# EasyEDA Pro project 电机驱动板.epro

# Schematic 电机驱动板(stm32)
Create Date: 2024-04-03; Page Name: P1; Project Name: 轮腿机器人; Schematic Name: 电机驱动板(stm32); Update Date: 2024-05-11; Company: 嘉立创EDA; Page Size: A4; Version: V1.0
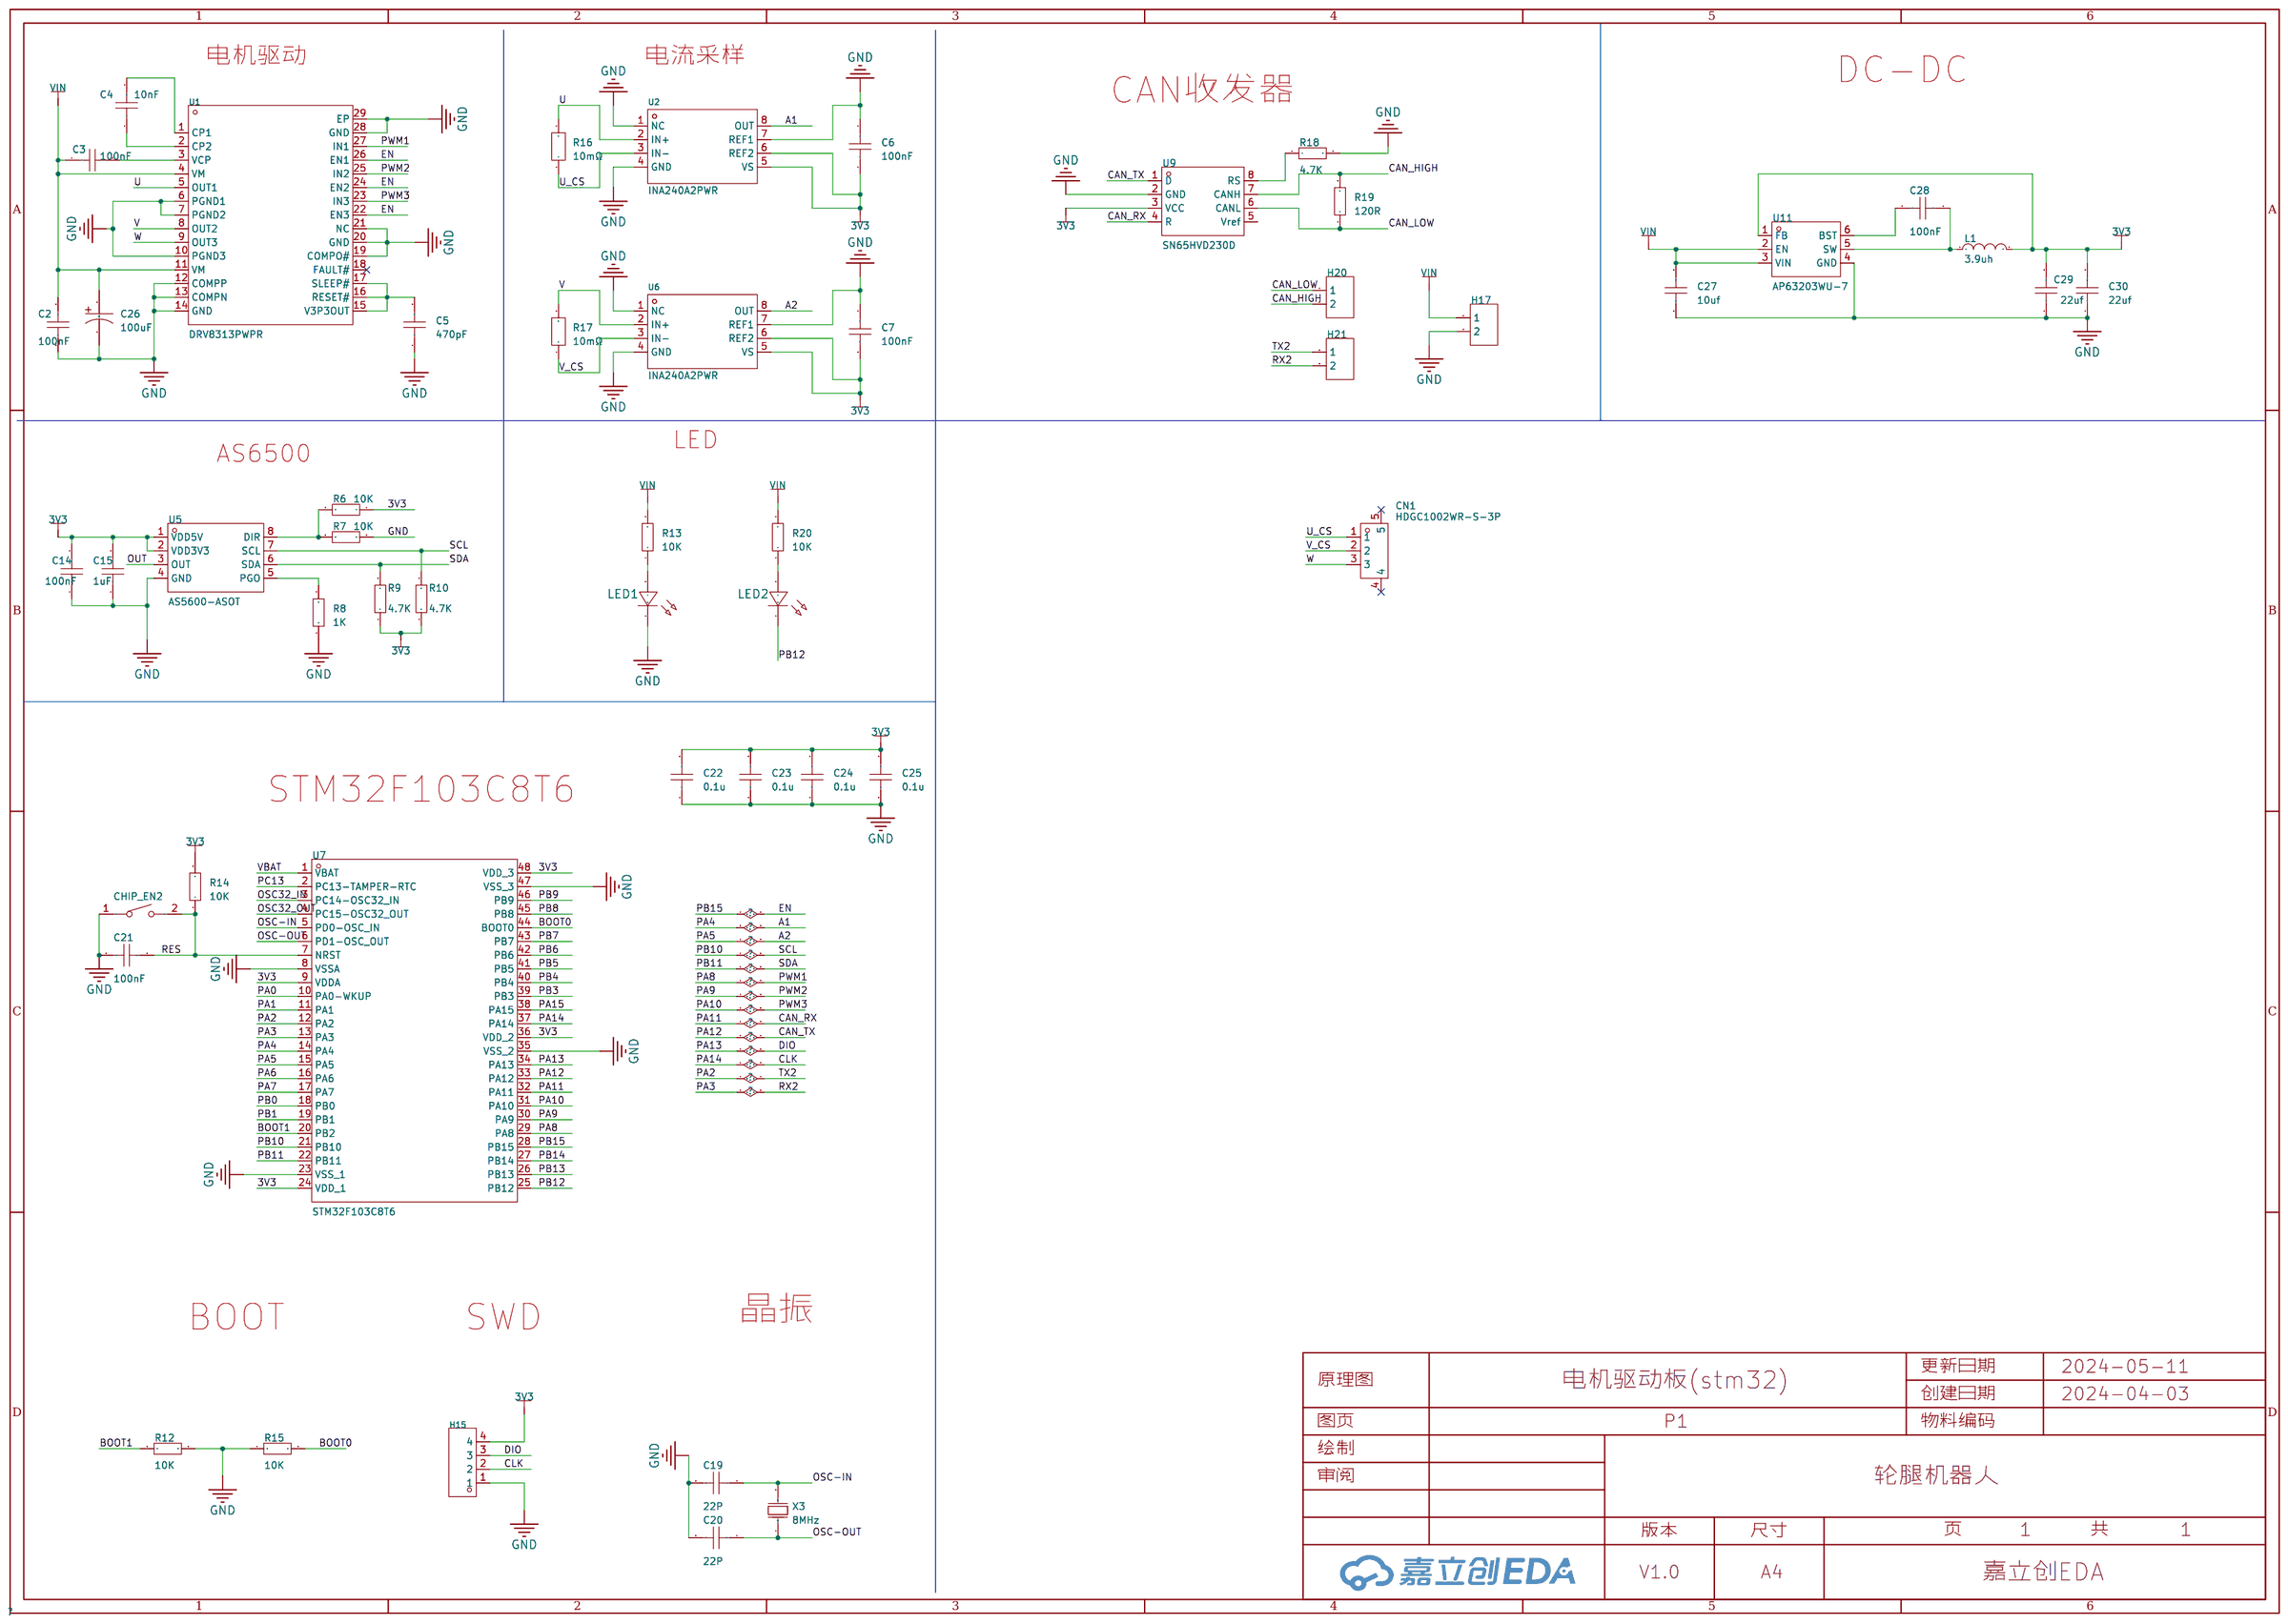
[diagram p0: schematic sheet]

## Parts
C2  100nF  [C0603]
C3  100nF  [C0603]
C4  10nF  [C0603]
C5  470pF  [C0603]
C6  100nF  [C0603]
C7  100nF  [C0603]
C14  100nF  [C0603]
C15  1uF  [C0603]
C19  22P  [C0603]
C20  22P  [C0603]
C21  100nF  [C0603]
C22  0.1u  [C0603]
C23  0.1u  [C0603]
C24  0.1u  [C0603]
C25  0.1u  [C0603]
C26  100uF  [CAP-SMD_L6.0-W3.2-R-RD]
C27  10uf  [C0603]
C28  100nF  [C0603]
C29  22uf  [C0603]
C30  22uf  [C0603]
CHIP_EN2  TS-1088-AR02016  [SW-SMD_L3.9-W3.0-P4.45]
CN1  HDGC1002WR-S-3P  [CONN-SMD_3P-P1.00_HDGC_HDGC1002WR-S-3P]
H15  -  [HDR-TH_4P-P2.54-V-F]
H17  -  [HDR-TH_2P-P2.54-V-F]
H20  -  [HDR-TH_2P-P2.54-V-F]
H21  -  [HDR-TH_2P-P2.54-V-F]
L1  3.9uh  [IND-SMD_L4.0-W4.0]
LED1  -  [LED_0603]
LED2  -  [LED_0603]
R6  10K  [R0603]
R7  10K  [R0603]
R8  1K  [R0603]
R9  4.7K  [R0603]
R10  4.7K  [R0603]
R12  10K  [R0603]
R13  10K  [R0603]
R14  10K  [R0603]
R15  10K  [R0603]
R16  10mΩ  [R1206]
R17  10mΩ  [R1206]
R18  4.7K  [R0603]
R19  120R  [R0603]
R20  10K  [R0603]
U1  DRV8313PWPR  [HTSSOP-28_L9.8-W4.5-P0.65-LS6.6-BL-EP]
U2  INA240A2PWR  [TSSOP-8_L4.4-W3.0-P0.65-LS6.4-BL]
U5  AS5600-ASOT  [SOIC-8_L5.0-W4.0-P1.27-LS6.0-BL]
U6  INA240A2PWR  [TSSOP-8_L4.4-W3.0-P0.65-LS6.4-BL]
U7  STM32F103C8T6  [LQFP-48_L7.0-W7.0-P0.50-LS9.0-BL]
U9  SN65HVD230D  [SOIC-8_L4.9-W3.9-P1.27-LS6.0-BL]
U11  AP63203WU-7  [TSOT-26_L2.9-W1.6-P0.95-LS2.8-BL]
X3  8MHz  [CRYSTAL-SMD_L5.0-W3.2]

## Library data of the parts
C2-C7 C14 C15 C19-C25 C27-C30 = CAP_0603: Supplier Footprint: 0603
C26 = CA45-C-10V-100μF-K: 容值:100uF;精度:±10%;额定电压:10V;等效串联电阻:300mΩ@100kHz;; LCSC Part Name: 100uF ±10% 10V; Supplier Part: C171664; Manufacturer: TORCH(火炬); Supplier Footprint: CASE-C-6032; JLCPCB Part Class: 扩展库; Datasheet: https://atta.szlcsc.com/upload/public/pdf/source/20180207/C171664_15179894835581356208.pdf; Supplier: LCSC; Tolerance: ±10%; Rated Voltage: 10V; Equivalent Series Resistance(ESR): 300mΩ@100kHz; Operating Temperature: -55℃~+125℃
CHIP_EN2 = TS-1088-AR02016: 触点电流:50mA;额定电压(DC):12V;绝缘电阻:100MΩ;电路结构:单刀单掷;安装方式:立贴;作用力:160gf@±50gf;机械寿命:10万次;带支架:否;; LCSC Part Name: 4*3*2mm 立贴 轻触开关; Supplier Part: C720477; Manufacturer: XUNPU(讯普); Supplier Footprint: SMD; JLCPCB Part Class: 扩展库; Datasheet: https://atta.szlcsc.com/upload/public/pdf/source/20200810/C720475_60D09DD6C54279ADDB2DC25100F1CC11.pdf; Supplier: LCSC; Contact Current: 50mA; Voltage Rating (DC): 12V; Insulation Resistance: 100MΩ; Circuit: 单刀单掷; Mounting Style: 立贴; Actuator Style: 圆形按钮; Actuator/Cap Color: 黑色; Operating Force: 160gf@±50gf; Mechanical Life: 10万次; Operating Temperature: -30℃~+80℃; Pin Style: SMD接片; Switch Length: 4mm; Switch Width: 3mm; Switch Height: 2mm; Strike Gundam: 否
CN1 = HDGC1002WR-S-3P: 参考系列:-;间距:1mm;插针结构:1x3P;排数:1;每排PIN数:3;行距:-;公母:公型插针;安装方式:卧贴;额定电流:1A;工作温度范围:-25℃~+70℃;; LCSC Part Name: 间距:1mm 1x3P 卧贴; Supplier Part: C2936213; Manufacturer: HDGC(华德共创); Supplier Footprint: SMD,P=1mm; JLCPCB Part Class: 扩展库; Datasheet: https://atta.szlcsc.com/upload/public/pdf/source/20211229/E8A09E85670B5E97244D2008A24D97FE.pdf; Supplier: LCSC; Pitch: 1mm; Pins Structure: 1x3P; Number of Rows: 1; Number of PINs Per Row: 3; Gender: 公型插针; Mounting Style: 卧贴; Current Rating (Max): 1A; Operating Temperature Range: -25℃~+70℃
H15 = HDR-F_2.54_1x4P: Supplier Part: C2718488; Supplier Footprint: 插件
H17 H20 H21 = HDR-F_2.54_1x2P: Supplier Part: C49661; Supplier Footprint: 插件
L1 = SWPA4030S681MT: 电感值:680uH;精度:±20%;额定电流:140mA;饱和电流(Isat):190mA;; LCSC Part Name: 680uH ±20% 190mA; Supplier Part: C370482; Manufacturer: Sunlord(顺络); Supplier Footprint: 4030; JLCPCB Part Class: 扩展库; Datasheet: https://atta.szlcsc.com/upload/public/pdf/source/20231024/317626D2AA2F8AB4113C1875E432E6E1.pdf; Supplier: LCSC; Tolerance: ±20%; Rated Current: 140mA; Saturation Current (Isat): 190mA; DC Resistance (DCR): 9.854Ω
LED1 LED2 = LED_0603-R: Supplier Footprint: 0603
R6-R10 R12-R15 R18-R20 = Res_0603: Supplier Footprint: 0603
R16 R17 = MFJ06HR010FT: 电阻类型:采样电阻;阻值:10mΩ;精度:±1%;功率:1W;温度系数:±50ppm/℃;; LCSC Part Name: 10mΩ ±1% 1W; Supplier Part: C2961483; Manufacturer: FH(风华); Supplier Footprint: 1206; JLCPCB Part Class: 扩展库; Datasheet: https://atta.szlcsc.com/upload/public/pdf/source/20220214/48262AE2350561E4ADC39CA7942CE443.pdf; Supplier: LCSC; Type: 采样电阻; Tolerance: ±1%; Power(Watts): 1W; Temperature Coefficient: ±50ppm/℃
U1 = DRV8313PWPR: 类型:无刷直流BLDC;电源电压:8V~60V;输出电流:-;接口:并行;; LCSC Part Name: 无刷直流BLDC电机驱动芯片 60V; Supplier Part: C92482; Manufacturer: TI(德州仪器); Supplier Footprint: TSSOP-28-EP; JLCPCB Part Class: 扩展库; Datasheet: https://www.ti.com/cn/lit/gpn/drv8313; Supplier: LCSC; Type: 无刷直流BLDC; Supply Voltage: 8V~60V; Interface: 并行; Operating Temperature: -40℃~+150℃@(Tj)
U2 U6 = INA240A2PWR: 通道数:1;; Supplier Part: C129949; Manufacturer: TI(德州仪器); Supplier Footprint: TSSOP-8; JLCPCB Part Class: 扩展库; Datasheet: https://www.ti.com/cn/lit/gpn/ina240; Supplier: LCSC; Number of Channels: 1; Supply Current: 1.8mA; Operating Temperature: -40℃~+125℃
U5 = AS5600-ASOT: Supplier Part: C499458; Manufacturer: ams(艾迈斯半导体); Supplier Footprint: SOIC-8; JLCPCB Part Class: 扩展库; Datasheet: https://atta.szlcsc.com/upload/public/pdf/source/20200324/C499458_E1461AFB0CE1042DE5756821C534625C.pdf; Supplier: LCSC
U7 = STM32F103C8T6: CPU内核:ARM Cortex-M3;CPU最大主频:72MHz;程序存储容量:64KB;程序存储器类型:FLASH;RAM总容量:20KB;GPIO端口数量:37;; LCSC Part Name: ARM Cortex-M3 72MHz MSL=3; Supplier Part: C8734; Manufacturer: ST(意法半导体); Supplier Footprint: LQFP-48(7x7); JLCPCB Part Class: 基础库; Datasheet: https://atta.szlcsc.com/upload/public/pdf/source/20220812/8363ACEC51AD55ECEB84799464F7CB85.pdf; Supplier: LCSC; CPU Core: ARM Cortex-M3; CPU Maximum Speed: 72MHz; Operating Voltage Range: 2V~3.6V; Program Storage Size: 64KB; Program Memory Type: FLASH; RAM Size: 20KB; GPIO Ports Number: 37; ADC (Bit): 12bit; Universal Serial Bus: 有; Peripheral/Function: 看门狗；DMA；看门狗；片载温度传感器; Watchdog: 有; Infrared Data Association: 有; Low-Voltage Detect: 有; Direct Memory Access: 有; Internal Oscillator: 有; Operating Temperature Range: -40℃~+85℃
U9 = SN65HVD230D: 类型:收发器;数据速率:1Mbps;; Supplier Part: C1543812; Manufacturer: TI(德州仪器); Supplier Footprint: SOIC-8; JLCPCB Part Class: 扩展库; Datasheet: https://www.ti.com/cn/lit/gpn/sn65hvd232; Supplier: LCSC; Type: 收发器; Data Rate: 1Mbps; Supply Voltage: 3V~3.6V; Operating Temperature: -40℃~+85℃
U11 = AP63203WU-7: 功能类型:降压型;输出类型:固定;输入电压:3.8V~32V;输出电压:3.3V;输出电流(最大值):2A;; Supplier Part: C780769; Manufacturer: DIODES(美台); Supplier Footprint: TSOT-23-6; JLCPCB Part Class: 扩展库; Datasheet: https://atta.szlcsc.com/upload/public/pdf/source/20210622/C780769_099C67289BD3EC61AAFB52D8B07125B3.pdf; Supplier: LCSC; Function: 降压型; Output Type: 固定; Input Voltage: 3.8V~32V; Output Voltage: 3.3V; Output Current (Max): 2A; Switching Frequency: 1.1MHz; Operating Temperature: -40℃~+85℃@(TA); Synchronous Rectification: 是; Number of Outputs: 1; Topology: 降压式; Switch tube (built-in/external): 内置
X3 = X50328MSB2GI: 晶振类型:贴片晶振;频率:8MHz;常温频差:±10ppm;外接负载电容:20pF;频率稳定度(全温):±20ppm;; LCSC Part Name: 8MHz ±10ppm 20pF YSX530GA; Supplier Part: C115962; Manufacturer: YXC(扬兴晶振); Supplier Footprint: SMD5032; JLCPCB Part Class: 基础库; Datasheet: https://atta.szlcsc.com/upload/public/pdf/source/20240329/44922B0AF7B60E58E9B66993B6077277.pdf; Supplier: LCSC; Crystal Type: 贴片晶振; Normal temperature Frequency Tolerance: ±10ppm; External load capacitor: 20pF; Frequency Stability(Full temperature range): ±20ppm; Operating Temperature: -40℃~+85℃

## Nets
3V3: C6.2 C7.2 C14.2 C15.2 C22.2 C23.2 C24.2 C25.2 C29.2 C30.2 H15.4 L1.2 R6.1 R9.1 R10.1 R14.2 U2.5(VS) U2.6(REF2) U5.1(VDD5V) U5.2(VDD3V3) U6.5(VS) U6.6(REF2) U7.9(VDDA) U7.24(VDD_1) U7.36(VDD_2) U7.48(VDD_3) U9.3(VCC) U11.1(FB)
GND: C2.1 C5.1 C6.1 C7.1 C14.1 C15.1 C19.2 C20.2 C21.1 C22.1 C23.1 C24.1 C25.1 C26.2 C27.1 C29.1 C30.1 CHIP_EN2.1 H15.1 H17.2 LED1.1(C) R7.2 R8.1 R12.2 R15.1 R18.2 U1.6(PGND1) U1.7(PGND2) U1.10(PGND3) U1.12(COMPP) U1.13(COMPN) U1.14(GND) U1.19(COMPO#) U1.20(GND) U1.21(NC) U1.28(GND) U1.29(EP) U2.1(NC) U2.4(GND) U2.7(REF1) U5.4(GND) U6.1(NC) U6.4(GND) U6.7(REF1) U7.8(VSSA) U7.23(VSS_1) U7.35(VSS_2) U7.47(VSS_3) U9.2(GND) U11.4(GND)
VBAT: U7.1(VBAT)
VIN: C2.2 C3.1 C26.1 C27.2 H17.1 R13.2 R20.2 U1.4(VM) U1.11(VM) U11.2(EN) U11.3(VIN)
A1: U2.8(OUT) U7.14(PA4)
A2: U6.8(OUT) U7.15(PA5)
BOOT0: R15.2 U7.44(BOOT0)
BOOT1: R12.1 U7.20(PB2)
CAN_HIGH: H20.2 R19.2 U9.7(CANH)
CAN_LOW: H20.1 R19.1 U9.6(CANL)
CAN_RX: U7.32(PA11) U9.4(R)
CAN_TX: U7.33(PA12) U9.1(D)
CLK: H15.2 U7.37(PA14)
DIO: H15.3 U7.34(PA13)
EN: U1.22(EN3) U1.24(EN2) U1.26(EN1) U7.28(PB15)
OSC32_IN: U7.3(PC14-OSC32_IN)
OSC32_OUT: U7.4(PC15-OSC32_OUT)
OSC-IN: C19.1 U7.5(PD0-OSC_IN) X3.2(OSC2)
OSC-OUT: C20.1 U7.6(PD1-OSC_OUT) X3.1(OSC1)
OUT: U5.3(OUT)
PA0: U7.10(PA0-WKUP)
PA1: U7.11(PA1)
PA2: H21.1 U7.12(PA2)
PA3: H21.2 U7.13(PA3)
PA6: U7.16(PA6)
PA7: U7.17(PA7)
PA8: U1.27(IN1) U7.29(PA8)
PA9: U1.25(IN2) U7.30(PA9)
PA10: U1.23(IN3) U7.31(PA10)
PA15: U7.38(PA15)
PB0: U7.18(PB0)
PB1: U7.19(PB1)
PB3: U7.39(PB3)
PB4: U7.40(PB4)
PB5: U7.41(PB5)
PB6: U7.42(PB6)
PB7: U7.43(PB7)
PB8: U7.45(PB8)
PB9: U7.46(PB9)
PB10: R10.2 U5.7(SCL) U7.21(PB10)
PB11: R9.2 U5.6(SDA) U7.22(PB11)
PB12: LED2.1(C) U7.25(PB12)
PB13: U7.26(PB13)
PB14: U7.27(PB14)
PC13: U7.2(PC13-TAMPER-RTC)
RES: C21.2 CHIP_EN2.2 R14.1 U7.7(NRST)
U: R16.2 U1.5(OUT1) U2.2(IN+)
U_CS: CN1.1 R16.1 U2.3(IN-)
V: R17.2 U1.8(OUT2) U6.2(IN+)
V_CS: CN1.2 R17.1 U6.3(IN-)
W: CN1.3 U1.9(OUT3)
$1N1543: C3.2 U1.3(VCP)
$1N1545: C4.2 U1.1(CP1)
$1N1546: C4.1 U1.2(CP2)
$1N1568: C5.2 U1.15(V3P3OUT) U1.16(RESET#) U1.17(SLEEP#)
$1N1605: R6.2 R7.1 U5.8(DIR)
$1N1610: R8.2 U5.5(PGO)
$1N1619: LED1.2(A) R13.1
$1N6079: R18.1 U9.8(RS)
$1N11263: C28.2 U11.6(BST)
$1N11271: C28.1 L1.1 U11.5(SW)
$1N15188: LED2.2(A) R20.1

Not connected (* = marked no-connect by the designer): CN1 4* 5*; U1 18(FAULT#)*; U9 5(Vref)

## Notes on the sheet
- 电机驱动
- 电流采样
- DC-DC
- CAN收发器
- LED
- AS6500
- STM32F103C8T6
- 晶振
- BOOT
- SWD

# Board 电机驱动板(stm32)
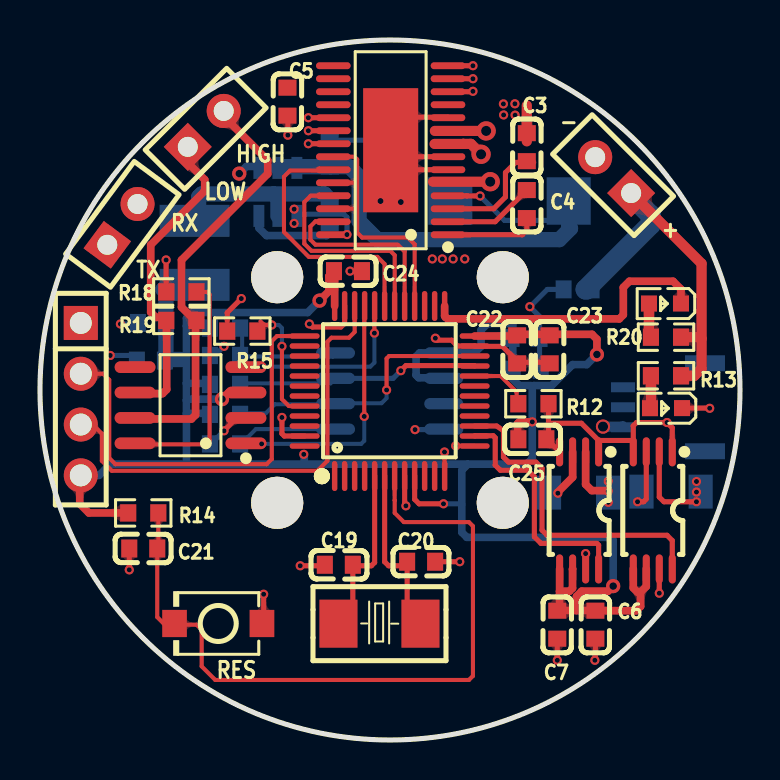
[diagram p1: board, top side]
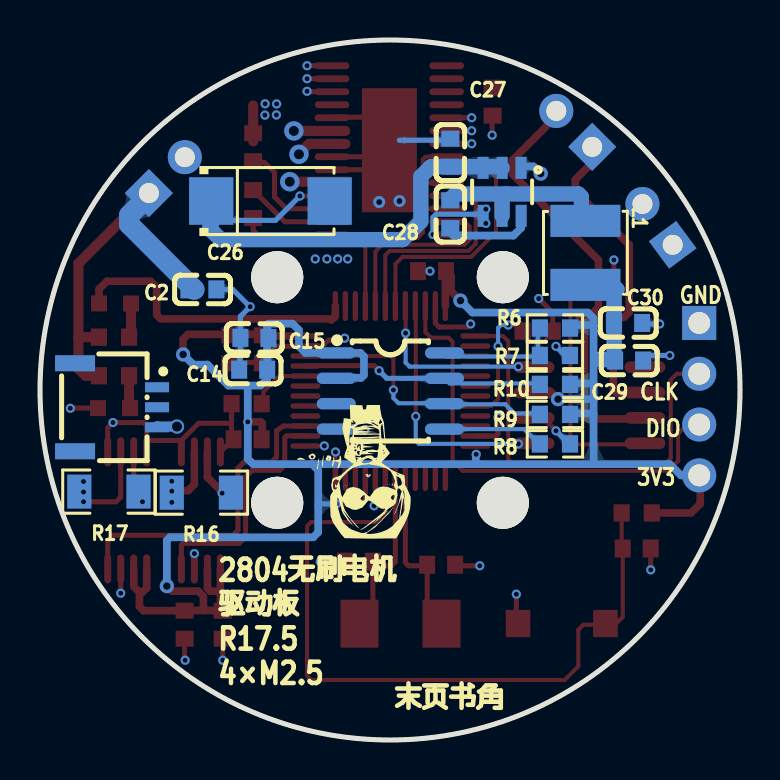
[diagram p2: board, bottom side, seen from below]

Outline 35 x 35 mm; copper layers: Top Layer, GND, VCC, Bottom Layer. Coordinates in mm from the lower left corner of the outline.
Outline path: circle c17.5,17.5 r17.5
Stack: Top Layer 0.035mm 外层铜厚1oz / Dielectric1 0.2104mm 7628 RC49% 8.6mil / GND 0.0152mm 内层铜厚 / Dielectric2 1.065mm 1.1mm H/HOZ 含铜 / VCC 0.0152mm 内层铜厚 / Dielectric3 0.2104mm 7628 RC49% 8.6mil / Bottom Layer 0.035mm 外层铜厚1oz

## Design rules (mm)
template: 自定义配置
spacing copperThickness1oz (default): track to track 0.102, other pairs 0.152 to 0.3
spacing copperThickness2oz: track to track 0.203, other pairs 0.152 to 0.3
track width copperThickness1oz (default): min 0.127, default 0.254, max 2.54
track width copperThickness2oz: min 0.203, default 0.254, max 2.54
differential pair differentialPair (default): width min 0.127, default 0.254, max 2.54; gap min 0.152, default 0.152
via viaSize (default): diameter min 0.457, default 0.61, max 10; hole min 0.254, default 0.305, max 6.299

## Placement (name value [footprint] x y rotation side)
C2  100nF  [C0603]  26.88 22.53 0 bottom
C3  100nF  [C0603]  24.34 29.64 270 top
C4  10nF  [C0603]  24.34 26.8 270 top
C5  470pF  [C0603]  12.37 31.92 90 top
C6  100nF  [C0603]  27.77 5.77 90 top
C7  100nF  [C0603]  25.86 5.77 90 top
C14  100nF  [C0603]  24.34 18.52 180 bottom
C15  1uF  [C0603]  24.28 20.11 180 bottom
C19  22P  [C0603]  14.94 8.76 180 top
C20  22P  [C0603]  19.06 8.91 0 top
C21  100nF  [C0603]  5.16 9.58 0 top
C22  0.1u  [C0603]  23.86 19.53 90 top
C23  0.1u  [C0603]  25.48 19.53 90 top
C24  0.1u  [C0603]  15.4 23.44 180 top
C25  0.1u  [C0603]  24.62 15.04 180 top
C26  100uF  [CAP-SMD_L6.0-W3.2-R-RD]  23.48 26.95 0 bottom
C27  10uf  [C0603]  14.49 29.36 270 bottom
C28  100nF  [C0603]  14.49 26.29 270 bottom
C29  22uf  [C0603]  5.6 20.85 0 bottom
C30  22uf  [C0603]  5.54 18.97 0 bottom
CHIP_EN2  TS-1088-AR02016  [SW-SMD_L3.9-W3.0-P4.45]  8.91 5.83 180 top
CN1  HDGC1002WR-S-3P  [CONN-SMD_3P-P1.00_HDGC_HDGC1002WR-S-3P]  31.2 16.64 270 bottom
H15  -  [HDR-TH_4P-P2.54-V-F]  2.04 17.04 270 top
H17  -  [HDR-TH_2P-P2.54-V-F]  28.66 28.24 135 top
H20  -  [HDR-TH_2P-P2.54-V-F]  8.29 30.56 45 top
H21  -  [HDR-TH_2P-P2.54-V-F]  4.12 25.78 53.4 top
L1  3.9uh  [IND-SMD_L4.0-W4.0]  7.73 24.36 270 bottom
LED1  -  [LED_0603]  31.25 16.59 180 top
LED2  -  [LED_0603]  31.2 21.82 180 top
NOREF  -  [Pad_e61]  11.86 11.86 225 top
NOREF#2  -  [Pad_e60]  23.14 11.86 315 top
NOREF#3  -  [Pad_e59]  11.86 23.14 135 top
NOREF#4  -  [Pad_e58]  23.14 23.14 45 top
R6  10K  [R0603]  9.25 20.6 0 bottom
R7  10K  [R0603]  9.25 19.23 180 bottom
R8  1K  [R0603]  9.25 14.81 0 bottom
R9  4.7K  [R0603]  9.25 16.28 0 bottom
R10  4.7K  [R0603]  9.25 17.78 0 bottom
R12  10K  [R0603]  24.67 16.81 0 top
R13  10K  [R0603]  31.3 18.21 0 top
R14  10K  [R0603]  5.16 11.35 180 top
R15  10K  [R0603]  10.12 20.45 0 top
R16  10mΩ  [R1206]  26.93 12.37 0 bottom
R17  10mΩ  [R1206]  31.55 12.42 0 bottom
R18  4.7K  [R0603]  7.07 22.4 180 top
R19  120R  [R0603]  7.07 20.98 0 top
R20  10K  [R0603]  31.3 20.14 0 top
U1  DRV8313PWPR  [HTSSOP-28_L9.8-W4.5-P0.65-LS6.6-BL-EP]  17.53 29.49 90 top
U2  INA240A2PWR  [TSSOP-8_L4.4-W3.0-P0.65-LS6.4-BL]  26.96 11.48 180 top
U5  AS5600-ASOT  [SOIC-8_L5.0-W4.0-P1.27-LS6.0-BL]  17.48 17.45 270 bottom
U6  INA240A2PWR  [TSSOP-8_L4.4-W3.0-P0.65-LS6.4-BL]  30.64 11.48 180 top
U7  STM32F103C8T6  [LQFP-48_L7.0-W7.0-P0.50-LS9.0-BL]  17.48 17.45 0 top
U9  SN65HVD230D  [SOIC-8_L4.9-W3.9-P1.27-LS6.0-BL]  7.53 16.74 90 top
U11  AP63203WU-7  [TSOT-26_L2.9-W1.6-P0.95-LS2.8-BL]  11.89 27.41 0 bottom
X3  8MHz  [CRYSTAL-SMD_L5.0-W3.2]  16.97 5.82 180 top

## Footprints (pads in the part's own frame, mm; a bottom-side part is the same pattern mirrored in y, then rotated)
C0603
  rect 0.8x0.9 smd: 1(-0.7,0) 2(0.7,0)
CAP-SMD_L6.0-W3.2-R-RD
  rect 2.208x2.376 smd: 1(2.961,0) 2(-2.961,0)
CONN-SMD_3P-P1.00_HDGC_HDGC1002WR-S-3P
  rect 0.5x1.2 smd: 1(-1,2.05) 2(0,2.05) 3(1,2.05)
  rect 0.8x2 smd: 4(2.2,-2.05) 5(-2.2,-2.05)
CRYSTAL-SMD_L5.0-W3.2
  rect 1.9x2.4 smd: 1(-2.05,0) 2(2.05,0)
HDR-TH_2P-P2.54-V-F
  rect 1.7x1.7 hole 1: 1(-1.27,0)
  round 1.7 hole 1: 2(1.27,0)
HDR-TH_4P-P2.54-V-F
  rect 1.7x1.7 hole 1.1: 1(-3.81,0)
  round 1.7 hole 1.1: 2(-1.27,0) 3(1.27,0) 4(3.81,0)
HTSSOP-28_L9.8-W4.5-P0.65-LS6.6-BL-EP
  oval 0.343x1.732 smd: 1(-4.225,-2.866) 2(-3.575,-2.866) 3(-2.925,-2.866) 4(-2.275,-2.866) 5(-1.625,-2.866) 6(-0.975,-2.866) 7(-0.325,-2.866) 8(0.325,-2.866) 9(0.975,-2.866) 10(1.625,-2.866) 11(2.275,-2.866) 12(2.925,-2.866) 13(3.575,-2.866) 14(4.225,-2.866) 15(4.225,2.866) 16(3.575,2.866) 17(2.925,2.866) 18(2.275,2.866) 19(1.625,2.866) 20(0.975,2.866) 21(0.325,2.866) 22(-0.325,2.866) 23(-0.975,2.866) 24(-1.625,2.866) 25(-2.275,2.866) 26(-2.925,2.866) 27(-3.575,2.866) 28(-4.225,2.866)
  rect 6.2x2.75 smd: 29(0,0)
IND-SMD_L4.0-W4.0
  rect 1.6x3.5 smd: 1(-1.6,0) 2(1.6,0)
LED_0603
  rect 0.8x0.8 smd: 1(-0.851,-0.01) 2(0.75,-0.005)
LQFP-48_L7.0-W7.0-P0.50-LS9.0-BL
  oval 0.27x1.5 smd: 1(-2.75,-4.25) 2(-2.25,-4.25) 3(-1.75,-4.25) 4(-1.25,-4.25) 5(-0.75,-4.25) 6(-0.25,-4.25) 7(0.25,-4.25) 8(0.75,-4.25) 9(1.25,-4.25) 10(1.75,-4.25) 11(2.25,-4.25) 12(2.75,-4.25) 25(2.75,4.25) 26(2.25,4.25) 27(1.75,4.25) 28(1.25,4.25) 29(0.75,4.25) 30(0.25,4.25) 31(-0.25,4.25) 32(-0.75,4.25) 33(-1.25,4.25) 34(-1.75,4.25) 35(-2.25,4.25) 36(-2.75,4.25)
  oval 1.5x0.27 smd: 13(4.25,-2.75) 14(4.25,-2.25) 15(4.25,-1.75) 16(4.25,-1.25) 17(4.25,-0.75) 18(4.25,-0.25) 19(4.25,0.25) 20(4.25,0.75) 21(4.25,1.25) 22(4.25,1.75) 23(4.25,2.25) 24(4.25,2.75) 37(-4.25,2.75) 38(-4.25,2.25) 39(-4.25,1.75) 40(-4.25,1.25) 41(-4.25,0.75) 42(-4.25,0.25) 43(-4.25,-0.25) 44(-4.25,-0.75) 45(-4.25,-1.25) 46(-4.25,-1.75) 47(-4.25,-2.25) 48(-4.25,-2.75)
Pad_e58
  round 2.6 hole 2.6: 9(0,0)
Pad_e59
  round 2.6 hole 2.6: 9(0,0)
Pad_e60
  round 2.6 hole 2.6: 9(0,0)
Pad_e61
  round 2.6 hole 2.6: 9(0,0)
R0603
  rect 0.806x0.864 smd: 1(-0.753,0) 2(0.753,0)
R1206
  rect 1.208x1.701 smd: 1(-1.479,0) 2(1.479,0)
SOIC-8_L4.9-W3.9-P1.27-LS6.0-BL
  oval 0.588x2.045 smd: 1(-1.905,-2.772) 2(-0.635,-2.772) 3(0.635,-2.772) 4(1.905,-2.772) 5(1.905,2.772) 6(0.635,2.772) 7(-0.635,2.772) 8(-1.905,2.772)
SOIC-8_L5.0-W4.0-P1.27-LS6.0-BL
  oval 0.569x1.95 smd: 1(-1.905,-2.705) 2(-0.635,-2.705) 3(0.635,-2.705) 4(1.905,-2.705) 5(1.905,2.705) 6(0.635,2.705) 7(-0.635,2.705) 8(-1.905,2.705)
SW-SMD_L3.9-W3.0-P4.45
  rect 1.23x1.36 smd: 1(-2.185,0) 2(2.185,0)
TSOT-26_L2.9-W1.6-P0.95-LS2.8-BL
  rect 0.55x1.1 smd: 1(-0.95,-1.2) 2(0,-1.2) 3(0.95,-1.2) 4(0.95,1.2) 5(0,1.2) 6(-0.95,1.2)
TSSOP-8_L4.4-W3.0-P0.65-LS6.4-BL
  oval 0.353x1.454 smd: 1(-0.975,-2.927) 2(-0.325,-2.927) 3(0.325,-2.927) 4(0.975,-2.927) 5(0.975,2.927) 6(0.325,2.927) 7(-0.325,2.927) 8(-0.975,2.927)

## Nets
As in the schematic.

Pads without a net: CN1 4 5; NOREF 9; NOREF#2 9; NOREF#3 9; NOREF#4 9; U1 18; U9 5

## Via types
v1: diameter 0.457, hole 0.254, Top Layer to Bottom Layer, 63 vias
v2: diameter 0.6, hole 0.3, Top Layer to Bottom Layer, 2 vias
v3: diameter 0.965, hole 0.508, Top Layer to Bottom Layer, 3 vias
v4: diameter 0.711, hole 0.381, Top Layer to Bottom Layer, 5 vias
v5: diameter 0.711, hole 0.508, Top Layer to Bottom Layer, 1 via

## Routing (per net, layer and track width the routed paths; a pad name or vN(x,y) marks a point on that pad's centre or on a via; arc(x,y) is an arc through that point)
3V3: length 129
  Top Layer w0.254: v1(20.17,11.81) 18.96,11.81 18.73,12.03 U7.9
  Top Layer w0.381: R14.2 2.45,11.35 1.99,11.81 1.99,13.18 H15.4 ; 30.03,7.39 29.88,7.39 29.66,7.6 U6.5 ; 30.03,7.39 30.31,7.67 U6.6 ; 30.03,7.39 30.03,6.68 29.82,6.47 C6.2 27.76,6.48 26.83,6.48 ; 26.83,6.48 25.88,6.48 ; 26.83,6.48 26.83,7.19 27.08,7.44 28.4,7.44 v4(28.66,7.7) ; 25.88,6.48 25.98,6.58 25.98,7.44 ; 25.88,6.48 C7.2 ; v4(9.1,17.04) 9.43,17.37 U9.3 ; v4(27.85,19.28) 27.85,20.04 27.6,20.28 23.86,20.28 23.77,20.2 U7.24 ; U2.6 26.63,8.55 26.63,7.59 26.47,7.44 25.98,7.44 ; 23.87,15.04 23.88,15.05 23.88,15.82 23.97,15.91 v1(24.61,15.91) ; 25.98,7.44 U2.5 ; v4(13.98,21.97) 14.45,22.44 14.45,23.19 C24.2 14.73,23.41 U7.36
  VCC w0.381: v4(9.96,28.32) 9.96,25.5 10.34,25.12 13.06,25.12 13.98,24.21 v4(13.98,21.97)
  Bottom Layer w0.254: 21.09,11.79 21.07,11.81 v1(20.17,11.81)
  Bottom Layer w0.381: 7.32,16.32 7.32,13.84 7.27,13.79 ; 7.32,16.32 7.33,16.33 8.6,16.33 ; 7.32,16.32 7.32,16.99 ; 7.32,17.84 7.33,17.83 8.6,17.83 ; 7.32,17.84 7.32,16.99 ; 7.32,17.84 7.32,20.7 ; 7.32,20.7 7.32,21.08 7.61,21.37 13.38,21.37 v4(13.98,21.97) ; 7.32,20.7 7.37,20.75 8.6,20.75 ; 21.39,13.79 21.09,13.49 21.09,10.39 21.34,10.13 28.51,10.13 28.66,9.98 v4(28.66,7.7) ; 21.39,13.79 13.32,13.79 ; 21.39,13.79 24.34,13.79 24.61,14.07 v1(24.61,15.91) 24.61,17.64 24.7,17.72 25.58,17.72 26.63,18.77 27.34,18.77 v4(27.85,19.28) ; 7.27,13.79 13.32,13.79 ; 7.27,13.79 3.51,13.79 2.95,13.23 H15.4 ; v1(13.19,14.28) 13.22,14.26 13.22,13.89 13.32,13.79 ; 7.32,16.99 7.37,17.04 v4(9.1,17.04) ; 24.53,17.72 23.96,17.72 23.64,18.05 C14.2 23.64,20.75 23.58,20.82 22.37,20.82 22.05,20.5 22.05,19.68 21.72,19.35 U5.1 18.98,19.35 18.8,19.18 18.8,18.25 18.94,18.11 20.16,18.11 U5.2 ; U11.1 10.87,28.68 10.32,28.68 v4(9.96,28.32)
  Bottom Layer w0.762: 7.93,22.76 6.38,22.76 6.15,22.53 6.3,22.39 C29.2 6.3,19.02 ; 6.3,19.02 C30.2 ; 6.3,19.02 7.07,19.02
GND: length 72.4
  Top Layer w0.254: LED1.1 33.47,16.6 v1(33.48,16.59) ; v1(12.1,16.13) 12.1,15.32 12.21,15.2 U7.47 ; v1(18.3,11.71) 18.23,11.77 U7.8 ; 20.42,31.11 20.38,31.14 18.06,31.14 ; U1.6 18.51,28.51 ; v1(10.07,22.07) 9.36,21.37 9.36,20.95 ; v1(11.18,7.29) 11.18,5.91 CHIP_EN2.1 ; U1.19 v1(13.42,31.11) ; 12.36,31.21 12.39,31.17 v1(12.39,30.24) ; U6.4 29.66,14.97 ; 29.66,14.97 29.66,15.71 29.83,15.87 v1(31.35,15.87) 31.61,15.61 U6.1 ; 29.66,14.97 29.66,14.98 27.93,14.98 ; U1.13 v1(21.65,33.06) ; v1(19.77,20.09) 19.87,19.99 20.58,19.99 20.87,19.7 U7.23 21.75,19.68 23.12,19.68 23.86,18.95 23.86,18.88 25.48,18.88 ; U6.7 v1(30.96,7.34) ; 25.42,15.84 25.42,15.14 C25.1 25.35,15.04 U2.4 ; 25.42,15.84 R12.2 ; 25.42,15.84 27.07,15.84 27.93,14.98 ; 25.42,15.84 25.44,15.82 ; v1(13.01,8.71) 14.19,8.71 C19.2 ; 4.46,9.58 v1(4.46,8.51) ; U1.12 21.63,32.41 v1(21.65,32.44) ; C6.1 27.77,4.01 v1(27.74,3.99) ; C24.1 v1(15.5,23.44) ; C7.1 v1(25.86,3.99) ; 27.93,14.41 27.93,14.98 ; v1(13.47,20.8) 13.62,20.65 15.04,20.65 15.23,20.84 U7.35 ; v1(6.31,24) 6.31,22.41 R18.2 ; v1(20.99,8.91) 19.76,8.91 ; U1.14 v1(21.65,33.71) ; U1.20 v1(13.42,30.46) ; U1.21 v1(13.42,29.81) ; v1(9.2,15.46) 9.2,15.47 9.84,16.1 U9.2 ; v1(27.28,9.32) 27.28,8.55 ; U1.7 17.86,29.16
  Bottom Layer w0.254: 17.03,29.99 14.56,29.99 C27.1 ; v1(18.75,15.52) 20.16,15.52 U5.4 ; 25.04,18.97 24.98,19.03 24.98,21.18 v1(24.49,21.67) 24.5,21.67 25.37,22.53 C2.1 ; 8.6,19.28 8.8,19.28 v1(9.2,19.68) ; C29.1 4.84,20.8 v1(4.02,20.8) ; 8.6,14.86 v1(9.2,15.46) 9.2,15.47 ; C30.1 4.59,19.23 v1(3.51,19.23) ; v1(15.35,25.27) 15.35,26.14 15.2,26.29 12.93,26.29 U11.4
  vias: v1(12.71,26.54) v1(12.71,25.83) v1(19.62,24.05) v1(20.12,24.05) v1(20.66,24.05) v1(21.24,24.05) v2(17.03,26.95) v2(18.04,26.9)
VIN: length 46.7
  Top Layer w0.254: v1(22,27.2) 21.34,27.2 21.33,27.21 20.37,27.21
  Top Layer w0.508: 33.08,20.07 33.08,18.57 32.72,18.21 R13.2 ; 33.08,20.07 33.08,23.82 H17.1 ; 33.08,20.07 33.01,20.14 32,20.14 ; 24.34,31.72 C3.1 24.34,29.93
  Bottom Layer w0.254: v1(22,27.2) 23.22,25.98 26.18,25.98 26.44,26.24
  Bottom Layer w0.762: 26.44,27 26.44,26.29 ; 26.44,26.24 26.44,25.66 26.52,25.58 25.97,25.02 16.87,25.02 15.96,25.93 15.96,28.17 15.46,28.66 11.95,28.66 U11.2
  Bottom Layer w1.016: 27.34,22.53 27.29,22.53 30.54,25.78 30.54,26.24 29.56,27.22 H17.1
  vias: v1(23.17,31.8) v1(23.18,31.25) v1(23.74,31.81) v1(23.76,31.24)
A1: length 12.2
  Top Layer w0.254: U7.14 21.75,15.21 22.66,15.21 22.76,15.11 22.76,13.74 23.02,13.49 24.39,13.49 24.72,13.16 24.72,10.16 25.05,9.83 27.85,9.83 27.93,9.74 27.93,8.55
A2: length 16.2
  Top Layer w0.254: U6.8 31.61,9.97 31.35,10.24 25.36,10.24 25.1,10.49 25.1,13.59 24.8,13.89 23.43,13.89 23.17,14.15 23.17,15.46 22.84,15.7 U7.15
BOOT0: length 6
  Top Layer w0.203: 13.18,16.7 12.44,16.7 12.1,17.04 v1(12.1,19.68) ; v1(11.59,20.75) 11.2,20.75 11.02,20.93
  Bottom Layer w0.203: v1(12.1,19.68) 12.1,20.6 11.95,20.75 v1(11.59,20.75)
BOOT1: length 3.1
  Top Layer w0.203: U7.20 23.03,18.2 23.83,17.4 23.83,16.7
CAN_HIGH: length 20.8
  Top Layer w0.381: 5.01,16.05 7.58,16.05 7.78,16.25 7.78,20.98 ; 7.75,20.97 7.08,21.64 7.08,24 11.39,28.31 11.39,28.98 9.55,30.82 9.03,30.82
CAN_LOW: length 14.5
  Top Layer w0.381: 6.31,21.13 5.8,21.13 5.54,21.39 5.54,24.75 8.24,27.46 8.24,28.02 7.23,29.02 ; 5.06,17.32 6.13,17.32 6.33,17.52 6.33,20.64
CAN_RX: length 8.6
  Top Layer w0.203: U7.32 16.72,21.69 v1(16.72,20.34)
  Bottom Layer w0.203: v1(16.72,20.34) 16.72,18.87 16.52,18.67 v1(11.08,18.67)
CAN_TX: length 12.5
  Top Layer w0.203: U7.33 16.21,21.68 v1(16.21,16.18) ; 10.55,14.83 10.58,14.81 v1(11.08,14.81)
  Bottom Layer w0.203: v1(11.08,14.81) 16.06,14.81 16.21,14.96 v1(16.21,16.18)
CLK: length 21.2
  Top Layer w0.203: H15.2 3.16,18.31 3.46,18.01 3.46,14.1 3.77,13.79 11.34,13.79 11.59,14.05 11.59,19.94 11.85,20.2 12.98,20.2
DIO: length 23.1
  Top Layer w0.203: U7.34 15.73,20.4 15.45,20.12 14.57,20.12 14.37,19.91 14.37,13.96 13.88,13.46 3.59,13.46 3.09,13.96 3.09,15.32 2.64,15.77 H15.3
EN: length 13.5
  Top Layer w0.203: 15.86,26.6 15.82,26.56 U1.26 ; 15.86,26.6 15.86,27.9 ; 15.86,26.6 15.86,25.37 16.11,25.12 18.4,25.12 18.73,24.78 U7.28 ; U1.22 15.72,29.16 15.86,29.03 15.86,27.9 ; 15.86,27.9 15.82,27.86 U1.24
OSC-IN: length 8.6
  Top Layer w0.254: 15.13,5.87 15.64,6.38 C19.1 15.69,8.71 16.57,8.71 16.73,8.88 U7.5
OSC-OUT: length 8.1
  Top Layer w0.254: 18.36,6.36 C20.1 18.15,8.71 17.43,8.71 17.23,8.91 U7.6
PA2: length 28.5
  Top Layer w0.203: U7.12 20.23,13.21 v1(20.23,14.4)
  VCC w0.203: 3.64,24.84 4.78,23.7 4.78,13.89 5.04,13.64 14.03,13.64 14.74,14.35 20.17,14.35 v1(20.23,14.4)
PA3: length 27.9
  Top Layer w0.203: U7.13 21.73,14.71 v1(20.78,14.71)
  VCC w0.203: v1(20.78,14.71) 20.53,14.96 20.53,21.21 20.38,21.36 6.2,21.36 5.75,21.82 5.75,25.78 4.88,26.65 H21.2
PA8: length 9.6
  Top Layer w0.203: U1.27 14.65,25.93 13.77,25.93 13.52,25.68 13.52,25.02 13.77,24.76 17.89,24.76 18.23,24.42 U7.29
PA9: length 11
  Top Layer w0.203: 17.74,21.8 17.74,24.24 17.51,24.46 13.57,24.46 13.22,24.81 13.22,26.9 13.53,27.21 14.77,27.21
PA10: length 13
  Top Layer w0.203: 17.23,21.8 17.23,23.8 16.87,24.15 13.44,24.15 12.2,25.4 12.2,28.17 12.5,28.47 14.52,28.47 14.57,28.51
PB10: length 12
  Top Layer w0.254: v1(18.04,18.47) 18.3,18.72 21.71,18.72 U7.21
  Bottom Layer w0.203: U5.7 14.52,17.83 10.11,17.83
  Bottom Layer w0.254: v1(18.04,18.47) 17.66,18.08 U5.7
PB11: length 14
  Top Layer w0.203: v1(17.33,17.5) 17.33,19.07 17.45,19.2 U7.22
  Bottom Layer w0.203: 10.11,16.33 11.28,16.33 11.74,16.79 14.75,16.79 U5.6 14.8,16.84 17.08,16.84 17.33,17.09 v1(17.33,17.5)
PB12: length 14.9
  Top Layer w0.381: LED2.1 32.05,22.54 31.66,22.94 29.47,22.94 29.17,22.63 29.17,21.26 28.96,21.06 20.48,21.06 20.43,21 20.23,21.2 U7.25
RES: length 37
  Top Layer w0.203: R14.1 5.92,9.63 C21.2 5.86,6.15 6.18,5.83 CHIP_EN2.2 6.79,5.77 7.83,5.77 8.08,5.51 8.08,3.68 8.77,3 21.44,3 21.65,3.2 21.65,10.69 21.44,10.9 18.19,10.9 17.74,11.35 17.74,11.98 17.73,11.99 U7.7
U: length 26.8
  Top Layer w0.381: v1(28.41,12.44) 28.38,12.47 27.59,12.47 27.28,12.78 27.28,14.41
  Top Layer w0.508: v3(22.51,27.91) 19.65,27.91
  VCC w0.508: v1(28.41,11.88) v1(28.41,12.44) v1(28.41,12.94) 28.41,13.38 27.85,13.94 26.17,13.94 25.66,14.45 25.66,27.51 25.25,27.91 v3(22.51,27.91)
U_CS: length 2.4
  Top Layer w0.381: U2.3 26.63,13.14 25.86,12.37
  vias: v1(25.89,12.34)
V: length 33.5
  Top Layer w0.254: v1(32.82,11.91) 31.2,11.91 30.96,12.15 U6.2
  Top Layer w0.508: 19.73,29.8 21.16,29.8 21.16,29.81 21.55,29.81 22.05,29.3 v3(22.05,29.29)
  VCC w0.508: v1(32.82,11.91) v1(32.82,12.4) v1(32.82,12.92) 32.82,14.05 32.32,14.55 26.78,14.55 26.37,14.96 26.37,27.86 25.36,28.88 22.46,28.88 v3(22.05,29.29)
V_CS: length 2.9
  Top Layer w0.254: U6.3 30.31,12.04 30.18,11.91 v1(29.88,11.91)
W: length 22.6
  Top Layer w0.508: v3(22.31,30.45) 19.74,30.45
  VCC w0.508: v3(22.31,30.45) 24.65,30.45 27.08,28.02 27.08,15.92 27.34,15.67 v5(28.15,15.67)
  Bottom Layer w0.508: 29.15,15.69 29.13,15.67 v5(28.15,15.67)
$1N1543: length 6
  Top Layer w0.254: U1.3 22.69,26.56 23.27,27.15 23.27,28.37 23.78,28.88 24.68,28.88
$1N1545: length 4.6
  Top Layer w0.254: U1.1 24.12,25.26 24.34,25.49 24.34,26.1
$1N1546: length 4.6
  Top Layer w0.254: C4.1 22.76,25.91 U1.2
$1N1605: length 6.2
  Bottom Layer w0.203: 10.11,20.75 10.11,19.28 ; 10.11,19.23 10.16,19.18 14.65,19.18 14.78,19.3
$1N1610: length 5
  Bottom Layer w0.203: 10.11,14.86 10.79,15.54 U5.5
$1N1619: length 1.6
  Top Layer w0.508: LED1.2 30.55,16.64 R13.1
$1N6079: length 11.5
  Top Layer w0.203: R18.1 8.35,22.4 8.48,22.27 8.48,14.98 8.28,14.78 5.06,14.78
$1N11263: length 4.6
  Bottom Layer w0.381: U11.6 10.94,25.6 11.33,25.22 14.33,25.22 14.54,25.42 14.54,25.59
$1N11271: length 9.2
  Bottom Layer w0.762: U11.5 11.89,27.1 11.69,27.3 ; 14.54,26.99 14.22,27.3 11.69,27.3 ; 11.69,27.3 8.08,27.3 7.93,27.15 7.93,25.96
$1N15188: length 1.7
  Top Layer w0.508: LED2.2 30.45,20.19 30.5,20.14

## Copper pours and planes (outline as drawn; the poured copper is in the pictures)
3V3 on Top Layer: 12.3,14.96 14.08,14.96 14.08,14.05 12.3,14.05
GND on Bottom Layer: 16.21,28.22 21.7,28.22 21.7,25.68 16.21,25.68
GND on GND: 35.65,17.93 35.61,18.76 35.54,19.6 35.42,20.43 35.27,21.25 35.07,22.06 34.85,22.87 34.58,23.66 34.28,24.44 33.94,25.21 33.57,25.96 33.16,26.69 32.72,27.4 32.24,28.09 31.74,28.76 31.2,29.41 30.64,30.02 30.05,30.62 29.43,31.18 28.79,31.72 28.12,32.22 27.43,32.69 26.72,33.13 25.98,33.54 25.23,33.91 24.47,34.25 23.69,34.55 22.89,34.82 22.09,35.05 21.27,35.24 20.45,35.4 19.62,35.51 18.79,35.59 17.95,35.63 17.11,35.63 16.28,35.59 15.44,35.51 14.62,35.4 13.79,35.24 12.98,35.05 12.17,34.82 11.38,34.55 10.6,34.25 9.83,33.91 9.08,33.54 8.35,33.13 7.64,32.69 6.95,32.22 6.28,31.72 5.64,31.18 5.02,30.62 4.43,30.02 3.86,29.41 3.33,28.76 2.82,28.09 2.35,27.4 1.91,26.69 1.5,25.96 1.13,25.21 0.79,24.44 0.49,23.66 0.22,22.87 -0.01,22.06 -0.2,21.25 -0.35,20.43 -0.47,19.6 -0.55,18.76 -0.58,17.93 -0.58,17.09 -0.55,16.25 -0.47,15.42 -0.35,14.59 -0.2,13.77 -0.01,12.95 0.22,12.15 0.49,11.35 0.79,10.57 1.13,9.81 1.5,9.06 1.91,8.33 2.35,7.62 2.82,6.92 3.33,6.26 3.86,5.61 4.43,4.99 5.02,4.4 5.64,3.84 6.28,3.3 6.95,2.8 7.64,2.32 8.35,1.88 9.08,1.48 9.83,1.1 10.6,0.77 11.38,0.46 12.17,0.2 12.98,-0.03 13.79,-0.22 14.62,-0.38 15.44,-0.49 16.28,-0.57 17.11,-0.61 17.95,-0.61 18.79,-0.57 19.62,-0.49 20.45,-0.38 21.27,-0.22 22.09,-0.03 22.89,0.2 23.69,0.46 24.47,0.77 25.23,1.1 25.98,1.48 26.72,1.88 27.43,2.32 28.12,2.8 28.79,3.3 29.43,3.84 30.05,4.4 30.64,4.99 31.2,5.61 31.74,6.26 32.24,6.92 32.72,7.62 33.16,8.33 33.57,9.06 33.94,9.81 34.28,10.57 34.58,11.35 34.85,12.15 35.07,12.95 35.27,13.77 35.42,14.59 35.54,15.42 35.61,16.25 35.65,17.09
VIN on Top Layer: 19.38,32.09 24.74,32.09 24.74,30.77 22.8,30.77 22.8,31.38 22.81,31.39 19.42,31.39 19.38,31.42
VIN on Bottom Layer: 22.82,32.08 26.68,32.08 26.68,25.17 26.73,25.12 27.81,25.12 27.81,21.51 26.42,21.51 26.42,23.49 25.31,23.49 25.25,23.55 25.25,30.81 22.8,30.81 22.82,30.82
U_CS on Bottom Layer: 24.55,13.33 24.55,11.29 27.27,11.29 27.29,11.3 27.29,17.27 30.71,17.27 30.74,17.3 30.74,18.21 26.42,18.21 26.37,18.17 26.37,13.28 24.59,13.28
V_CS on Bottom Layer: 28.4,17.14 30.8,17.14 30.8,11.23 29.42,11.23 29.42,15.06 29.94,15.06 29.91,15.09 29.91,16.07 28.38,16.07 28.38,17.12
$1N1568 on Top Layer: 10.98,33.15 13.47,33.15 13.47,34.03 13.49,34.01 15.76,34.01 15.76,32.08 15.59,31.92 10.98,31.92 10.98,31.92

Small or netless copper shapes (teardrops, artwork), in the pictures only: 143 on Top Layer, 74 on Bottom Layer, 7 on VCC

## Text on the board
Bottom Silkscreen Layer: GND | DIO | CLK | 3V3 | 末页书角 | 2804无刷电机 / 驱动板 / R17.5 / 4×M2.5
Top Silkscreen Layer: TX | RX | LOW | HIGH | - | + | RES
